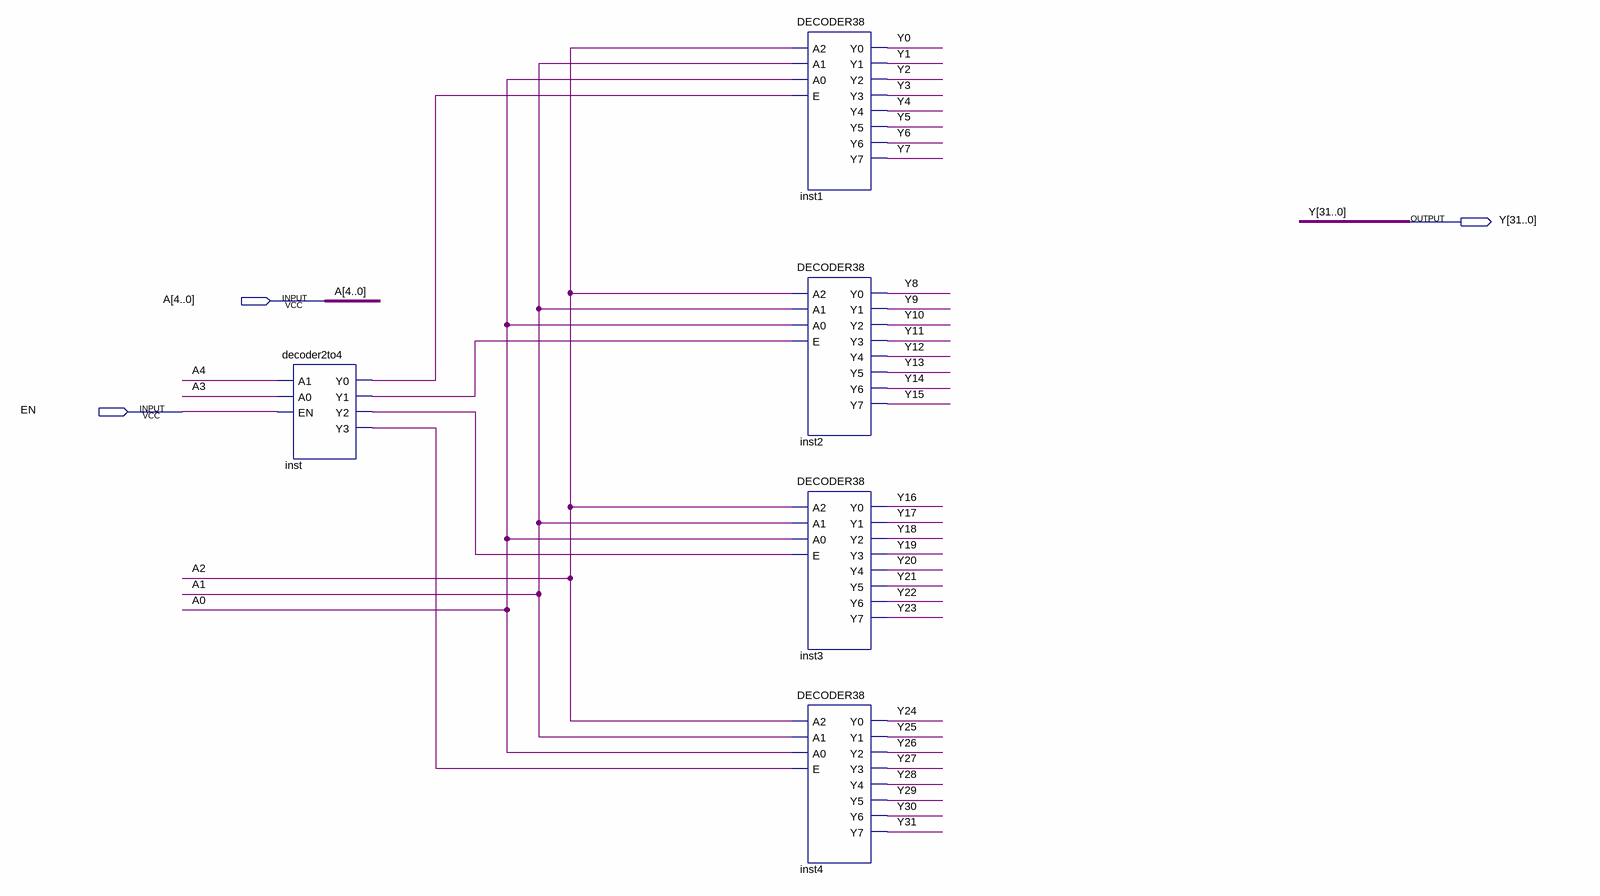
[diagram p0: schematic sheet]
// Quartus schematic decoder5to32.bdf as structural Verilog: 5 symbols, 3 pins
module decoder5to32 (
  input  [4:0] A,
  input  EN,
  output [31:0] Y
);

  wire inst_y0, inst_y1, inst_y2, inst_y3;

  decoder2to4 inst (.A1(A[4]), .A0(A[3]), .EN(EN), .Y0(inst_y0), .Y1(inst_y1), .Y2(inst_y2), .Y3(inst_y3));
  DECODER38 inst1 (
    .A2(A[2]), .A1(A[1]), .A0(A[0]), .E(inst_y0), .Y0(Y[0]), .Y1(Y[1]), .Y2(Y[2]), .Y3(Y[3]), .Y4(Y[4]),
    .Y5(Y[5]), .Y6(Y[6]), .Y7(Y[7]));
  DECODER38 inst2 (
    .A2(A[2]), .A1(A[1]), .A0(A[0]), .E(inst_y1), .Y0(Y[8]), .Y1(Y[9]), .Y2(Y[10]), .Y3(Y[11]), .Y4(Y[12]),
    .Y5(Y[13]), .Y6(Y[14]), .Y7(Y[15]));
  DECODER38 inst3 (
    .A2(A[2]), .A1(A[1]), .A0(A[0]), .E(inst_y2), .Y0(Y[16]), .Y1(Y[17]), .Y2(Y[18]), .Y3(Y[19]), .Y4(Y[20]),
    .Y5(Y[21]), .Y6(Y[22]), .Y7(Y[23]));
  DECODER38 inst4 (
    .A2(A[2]), .A1(A[1]), .A0(A[0]), .E(inst_y3), .Y0(Y[24]), .Y1(Y[25]), .Y2(Y[26]), .Y3(Y[27]), .Y4(Y[28]),
    .Y5(Y[29]), .Y6(Y[30]), .Y7(Y[31]));
endmodule
